# EAGLE design 40bus-node32 (EAGLE 7.4.0)
CNAME: 40BUS-NODE32; CREVISION: r1; DESIGNER: lamloei.com/40bus-node32
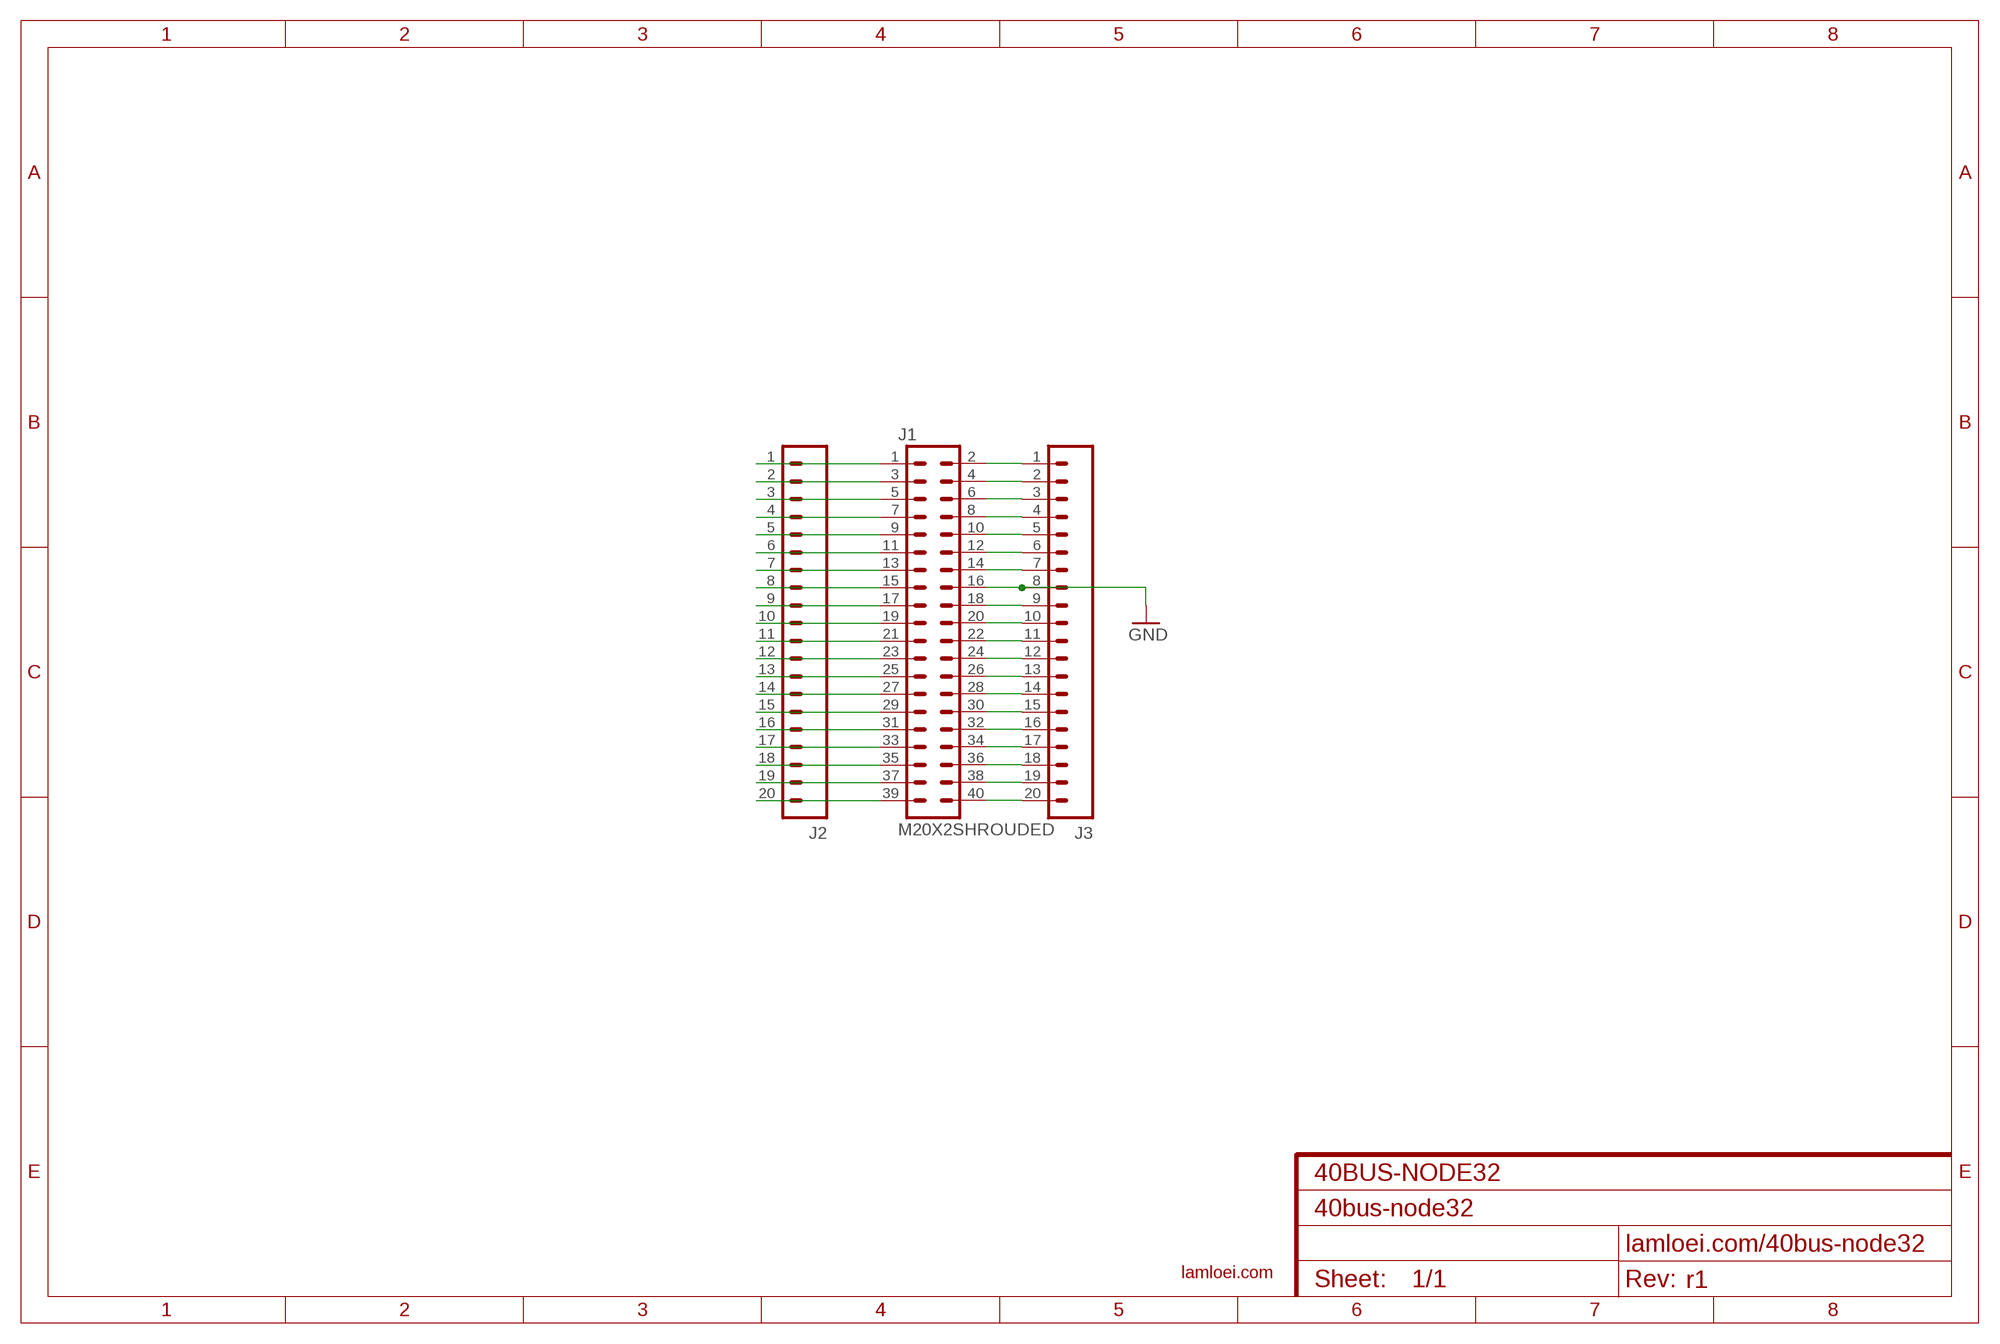
[diagram p0: schematic, sheet 1]

## Parts
J1  M20X2SHROUDED  [2X20_SHROUDED]
J2  M20  [1X20]
J3  M20  [1X20]
U$1  LAMLEOI_LOGO_3  [LAMLEOI_LOGO_3]

## Nets
GND: J1.16 J3.8
N$1: J1.2 J3.1
N$2: J1.4 J3.2
N$3: J1.6 J3.3
N$4: J1.8 J3.4
N$5: J1.10 J3.5
N$6: J1.12 J3.6
N$7: J1.14 J3.7
N$9: J1.18 J3.9
N$10: J1.20 J3.10
N$11: J1.22 J3.11
N$12: J1.24 J3.12
N$13: J1.26 J3.13
N$14: J1.28 J3.14
N$15: J1.30 J3.15
N$16: J1.32 J3.16
N$17: J1.34 J3.17
N$18: J1.36 J3.18
N$19: J1.38 J3.19
N$20: J1.40 J3.20
N$21: J1.1 J2.1
N$22: J1.3 J2.2
N$23: J1.5 J2.3
N$24: J1.7 J2.4
N$25: J1.9 J2.5
N$26: J1.11 J2.6
N$27: J1.13 J2.7
N$28: J1.15 J2.8
N$29: J1.17 J2.9
N$30: J1.19 J2.10
N$31: J1.21 J2.11
N$32: J1.23 J2.12
N$33: J1.25 J2.13
N$34: J1.27 J2.14
N$35: J1.29 J2.15
N$36: J1.31 J2.16
N$37: J1.33 J2.17
N$38: J1.35 J2.18
N$39: J1.37 J2.19
N$40: J1.39 J2.20

## Library data of the parts
J1 = SparkFun-Connectors:M20X2: 0.1" spaced headers; PROD_ID: CONN-12263
J2 = SparkFun-Connectors2:M20: 1x20 .1" header This is just like the LOCK variant in that the holes are staggared by 5 mil, but except for the last two holes. They are not altered from the "standard" footprint layout. This is used for a special purpose on the layout of our Graphic LCD Backpack. Make sure you want to use this device before selecting it for you project!
J3 = SparkFun-Connectors:M20: 1x20 .1" header This is just like the LOCK variant in that the holes are staggared by 5 mil, but except for the last two holes. They are not altered from the "standard" footprint layout. This is used for a special purpose on the layout of our Graphic LCD Backpack. Make sure you want to use this device before selecting it for you project!
U$1 = lamloei_logo_3:LAMLEOI_LOGO_3: lamloei

## Board
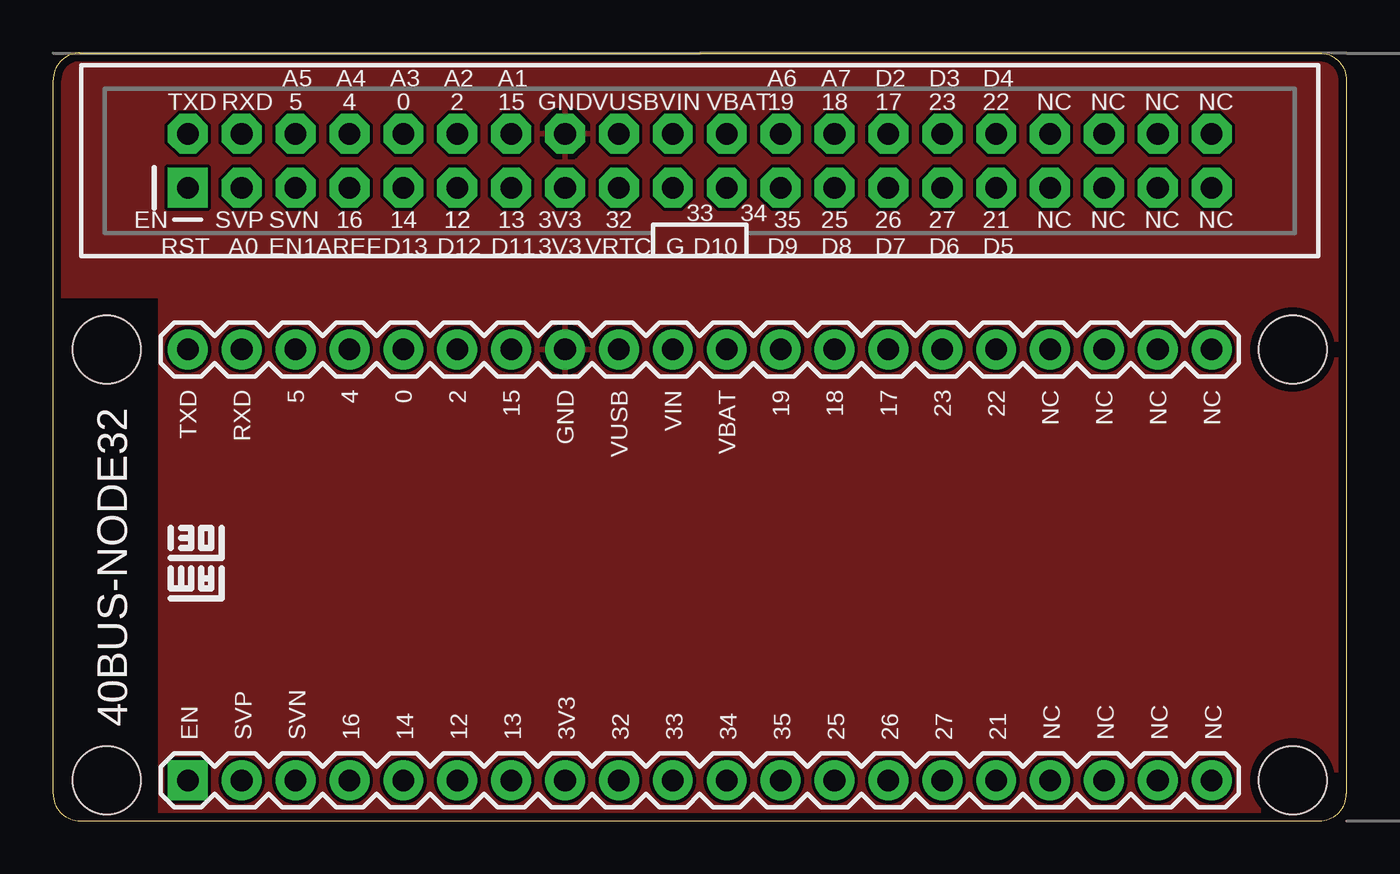
[diagram p1: board, top side]
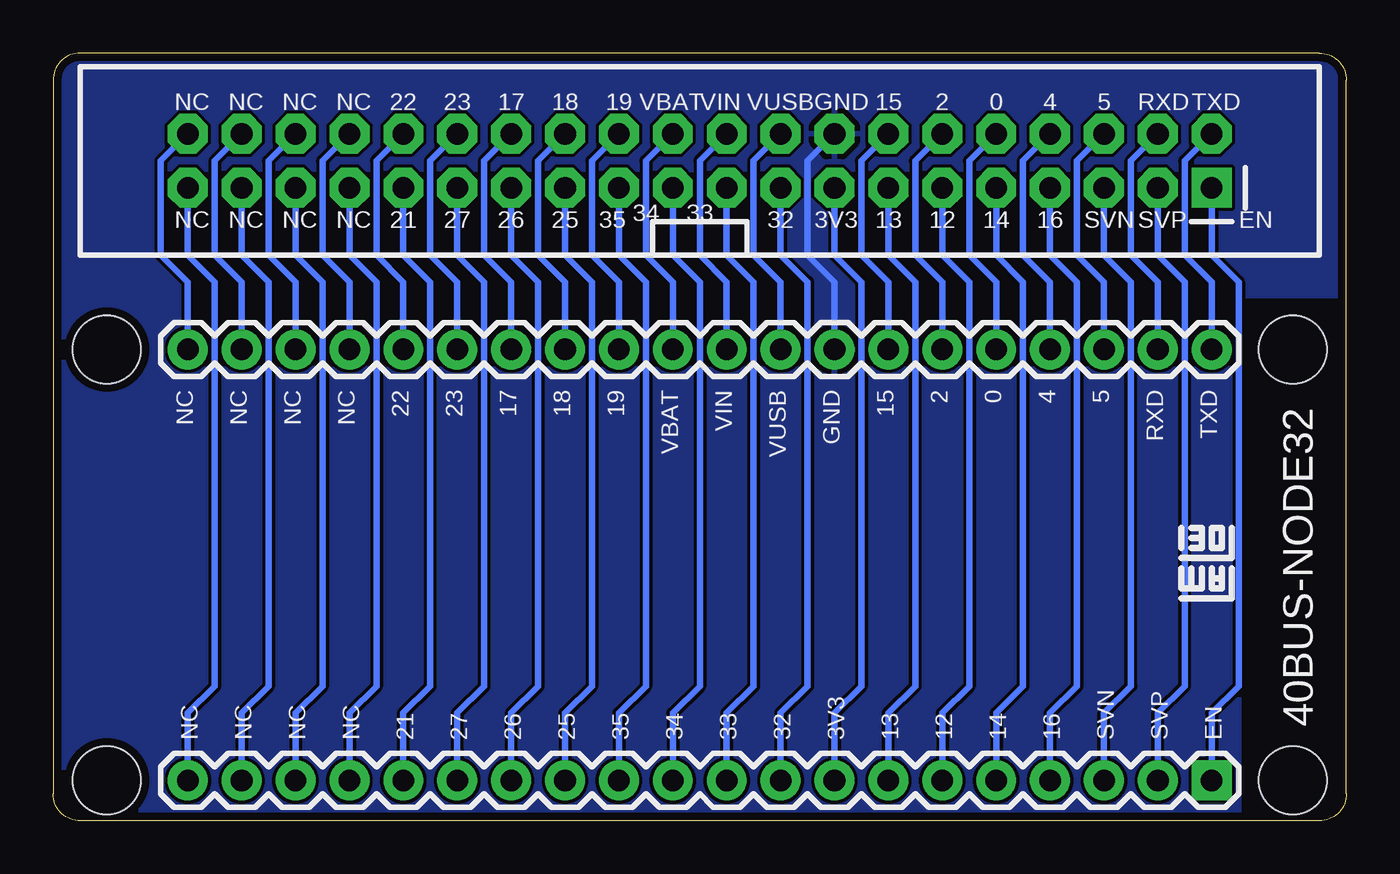
[diagram p2: board, bottom side, seen from below]

Size 60.96 x 36.2 mm. Coordinates in mm from the lower left corner, seen from the top.
Outline: 0,1.27 0,34.93 arc-90 1.27,36.2 59.69,36.2 arc-90 60.96,34.93 60.96,1.27 arc-90 59.69,0 1.27,0 arc-90 0,1.27
Copper layers (1*16): Top 0.0356mm / dielectric 1.5011mm / Bottom 0.0356mm
Design rules "PCBs_io2": minimum track width 6mil, minimum drill 13mil, track to track 6mil, track to pad 6mil, pad to pad 6mil, via to via 6mil, smd to smd 6mil, copper to edge 15mil, drill to drill 6mil, minimum pad ring 7mil, minimum via ring 7mil, stop-mask expansion 3mil, vias tented up to drill 25mil, thermal gap 10mil
Holes 3.2 mm at 2.54,1.91 2.54,22.23 58.42,1.91 58.42,22.23

### Footprints (pad centres in the part's own frame; a part is rotated, then mirrored left to right if it is on the bottom)
2X20_SHROUDED = drill 1.016 pad 1.88 square: 1 -1.27,24.13 | drill 1.016 pad 1.88 octagon: 2 1.27,24.13; 3 -1.27,21.59; 4 1.27,21.59; 5 -1.27,19.05; 6 1.27,19.05; 7 -1.27,16.51; 8 1.27,16.51; 9 -1.27,13.97; 10 1.27,13.97; 11 -1.27,11.43; 12 1.27,11.43; 13 -1.27,8.89; 14 1.27,8.89; 15 -1.27,6.35; 16 1.27,6.35; 17 -1.27,3.81; 18 1.27,3.81; 19 -1.27,1.27; 20 1.27,1.27; 21 -1.27,-1.27; 22 1.27,-1.27; 23 -1.27,-3.81; 24 1.27,-3.81; 25 -1.27,-6.35; 26 1.27,-6.35; 27 -1.27,-8.89; 28 1.27,-8.89; 29 -1.27,-11.43; 30 1.27,-11.43; 31 -1.27,-13.97; 32 1.27,-13.97; 33 -1.27,-16.51; 34 1.27,-16.51; 35 -1.27,-19.05; 36 1.27,-19.05; 37 -1.27,-21.59; 38 1.27,-21.59; 39 -1.27,-24.13; 40 1.27,-24.13
1X20 = drill 1.016 pad 1.88 square: 1 0,0 | drill 1.016 pad 1.88: 2 2.54,0; 3 5.08,0; 4 7.62,0; 5 10.16,0; 6 12.7,0; 7 15.24,0; 8 17.78,0; 9 20.32,0; 10 22.86,0; 11 25.4,0; 12 27.94,0; 13 30.48,0; 14 33.02,0; 15 35.56,0; 16 38.1,0; 17 40.64,0; 18 43.18,0; 19 45.72,0; 20 48.26,0
1X20' = drill 1.016 pad 1.88: 1 0,0; 2 2.54,0; 3 5.08,0; 4 7.62,0; 5 10.16,0; 6 12.7,0; 7 15.24,0; 8 17.78,0; 9 20.32,0; 10 22.86,0; 11 25.4,0; 12 27.94,0; 13 30.48,0; 14 33.02,0; 15 35.56,0; 16 38.1,0; 17 40.64,0; 18 43.18,0; 19 45.72,0; 20 48.26,0

### Placement (x,y rotation side)
J1  30.48,31.12 90 top
J2  6.35,1.91 0 top
J3  [1X20']  6.35,22.23 0 top
U$1  8.26,10.16 90 top
U$2  LAMLEOI_LOGO_3  [LAMLEOI_LOGO_3]  5.08,10.16 90 bottom

### Tracks (layer width: path | path; a pad name or v marks a point on that pad's centre or on a via)
GND
  Bottom 0.305: J1.16 25.4,31.12 25.4,26.67 24.13,25.4 J3.8
  pour Top: 5.08,0 60.96,0 60.96,36.2 0,36.2 0,24.77 5.08,24.77
  pour Bottom: 5.08,0 60.96,0 60.96,36.2 0,36.2 0,24.77 5.08,24.77
N$1
  Bottom 0.305: J1.2 7.62,31.12 7.62,26.67 6.35,25.4 J3.1
N$2
  Bottom 0.305: J3.2 8.89,25.4 10.16,26.67 10.16,31.12 J1.4
N$3
  Bottom 0.305: J1.6 12.7,31.12 12.7,26.67 11.43,25.4 J3.3
N$4
  Bottom 0.305: J1.8 15.24,31.12 15.24,26.67 13.97,25.4 J3.4
N$5
  Bottom 0.305: J1.10 17.78,31.12 17.78,26.67 16.51,25.4 J3.5
N$6
  Bottom 0.305: J1.12 20.32,31.12 20.32,26.67 19.05,25.4 J3.6
N$7
  Bottom 0.305: J1.14 22.86,31.12 22.86,26.67 21.59,25.4 J3.7
N$9
  Bottom 0.305: J1.18 27.94,31.12 27.94,26.67 26.67,25.4 J3.9
N$10
  Bottom 0.305: J1.20 30.48,31.12 30.48,26.67 29.21,25.4 J3.10
N$11
  Bottom 0.305: J1.22 33.02,31.12 33.02,26.67 31.75,25.4 J3.11
N$12
  Bottom 0.305: J1.24 35.56,31.12 35.56,26.67 34.29,25.4 J3.12
N$13
  Bottom 0.305: J1.26 38.1,31.12 38.1,26.67 36.83,25.4 J3.13
N$14
  Bottom 0.305: J1.28 40.64,31.12 40.64,26.67 39.37,25.4 J3.14
N$15
  Bottom 0.305: J1.30 43.18,31.12 43.18,26.67 41.91,25.4 J3.15
N$16
  Bottom 0.305: J1.32 45.72,31.12 45.72,26.67 44.45,25.4 J3.16
N$17
  Bottom 0.305: J1.34 48.26,31.12 48.26,26.67 46.99,25.4 J3.17
N$18
  Bottom 0.305: J1.36 50.8,31.12 50.8,26.67 49.53,25.4 J3.18
N$19
  Bottom 0.305: J1.38 53.34,31.12 53.34,26.67 52.07,25.4 J3.19
N$20
  Bottom 0.305: J1.40 55.88,31.12 55.88,26.67 54.61,25.4 J3.20
N$21
  Bottom 0.305: J1.1 6.35,26.67 5.08,25.4 5.08,6.35 6.35,5.08 J2.1
N$22
  Bottom 0.305: J2.2 8.89,5.08 7.62,6.35 7.62,25.4 8.89,26.67 J1.3
N$23
  Bottom 0.305: J2.3 11.43,5.08 10.16,6.35 10.16,25.4 11.43,26.67 J1.5
N$24
  Bottom 0.305: J1.7 13.97,26.67 12.7,25.4 12.7,6.35 13.97,5.08 J2.4
N$25
  Bottom 0.305: J1.9 16.51,26.67 15.24,25.4 15.24,6.35 16.51,5.08 J2.5
N$26
  Bottom 0.305: J1.11 19.05,26.67 17.78,25.4 17.78,6.35 19.05,5.08 J2.6
N$27
  Bottom 0.305: J2.7 21.59,5.08 20.32,6.35 20.32,25.4 21.59,26.67 J1.13
N$28
  Bottom 0.305: J1.15 24.13,26.67 22.86,25.4 22.86,6.35 24.13,5.08 J2.8
N$29
  Bottom 0.305: J1.17 26.67,26.67 25.4,25.4 25.4,6.35 26.67,5.08 J2.9
N$30
  Bottom 0.305: J1.19 29.21,26.67 27.94,25.4 27.94,6.35 29.21,5.08 J2.10
N$31
  Bottom 0.305: J1.21 31.75,26.67 30.48,25.4 30.48,6.35 31.75,5.08 J2.11
N$32
  Bottom 0.305: J1.23 34.29,26.67 33.02,25.4 33.02,6.35 34.29,5.08 J2.12
N$33
  Bottom 0.305: J1.25 36.83,26.67 35.56,25.4 35.56,6.35 36.83,5.08 J2.13
N$34
  Bottom 0.305: J1.27 39.37,26.67 38.1,25.4 38.1,6.35 39.37,5.08 J2.14
N$35
  Bottom 0.305: J1.29 41.91,26.67 40.64,25.4 40.64,6.35 41.91,5.08 J2.15
N$36
  Bottom 0.305: J1.31 44.45,26.67 43.18,25.4 43.18,6.35 44.45,5.08 J2.16
N$37
  Bottom 0.305: J1.33 46.99,26.67 45.72,25.4 45.72,6.35 46.99,5.08 J2.17
N$38
  Bottom 0.305: J1.35 49.53,26.67 48.26,25.4 48.26,6.35 49.53,5.08 J2.18
N$39
  Bottom 0.305: J1.37 52.07,26.67 50.8,25.4 50.8,6.35 52.07,5.08 J2.19
N$40
  Bottom 0.305: J1.39 54.61,26.67 53.34,25.4 53.34,6.35 54.61,5.08 J2.20

### Text on the board
tPlace: A5 | A4 | A3 | A2 | A1 | A6 | A7 | D2 | D3 | D4 | TXD | RXD | 5 | 4 | 0 | 2 | 15 | GND | VUSB | VIN | VBAT | 19 | 18 | 17 | 23 | 22 | NC | NC | NC | NC | 33 | 34 | EN | SVP | SVN | 16 | 14 | 12 | 12 | 13 | 3V3 | 32 | 35 | 25 | 26 | 27 | 21 | NC | NC | NC | NC | RST | A0 | EN1 | AREF | D13 | D12 | D11 | 3V3 | VRTC | G | D10 | D9 | D8 | D7 | D6 | D5 | TXD | RXD | 5 | 4 | 0 | 2 | 15 | GND | VUSB | VIN | VBAT | 19 | 18 | 17 | 23 | 22 | NC | NC | NC | NC | 40BUS-NODE32 | EN | SVP | SVN | 16 | 14 | 12 | 13 | 3V3 | 32 | 33 | 34 | 35 | 25 | 26 | 27 | 21 | NC | NC | NC | NC
bPlace: TXD | RXD | 5 | 4 | 0 | 2 | 15 | GND | VUSB | VIN | VBAT | 19 | 18 | 17 | 23 | 22 | NC | NC | NC | NC | 33 | 34 | EN | SVP | SVN | 16 | 14 | 12 | 13 | 3V3 | 32 | 35 | 25 | 26 | 27 | 21 | NC | NC | NC | NC | TXD | RXD | 5 | 4 | 0 | 2 | 15 | GND | VUSB | VIN | VBAT | 19 | 18 | 17 | 23 | 22 | NC | NC | NC | NC | 40BUS-NODE32 | EN | SVP | SVN | 16 | 14 | 12 | 13 | 3V3 | 32 | 33 | 34 | 35 | 25 | 26 | 27 | 21 | NC | NC | NC | NC